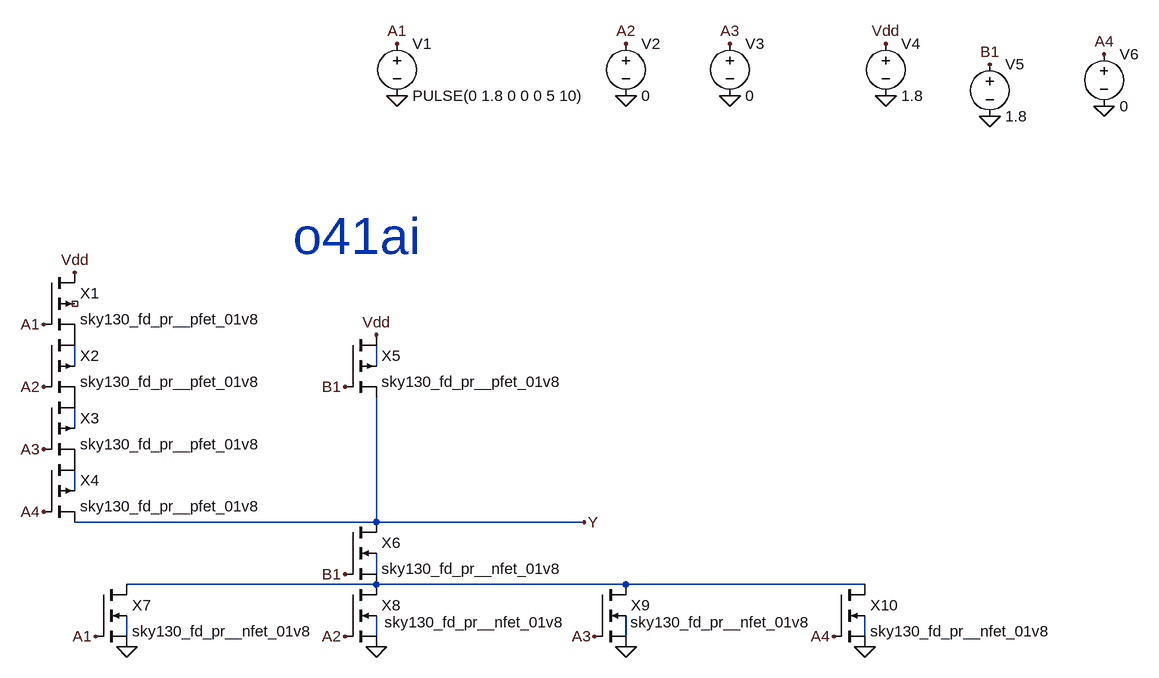
[diagram p0: schematic o41ai.asc]
o41ai.asc, the LTspice schematic file:
Version 4
SHEET 1 1176 680
WIRE -464 -128 -464 -160
WIRE 0 -128 0 -160
WIRE -464 -32 -464 -64
WIRE -464 64 -464 32
WIRE 0 112 0 -80
WIRE 0 112 -464 112
WIRE 320 112 0 112
WIRE 0 192 0 160
WIRE 0 208 -384 208
WIRE 384 208 0 208
WIRE 752 208 384 208
WIRE -384 288 -384 256
WIRE 0 288 0 256
WIRE 384 288 384 256
WIRE 752 288 752 256
FLAG -512 -96 A2
FLAG -512 0 A3
FLAG -512 96 A4
FLAG -48 192 B1
FLAG -384 304 0
FLAG 0 304 0
FLAG 384 304 0
FLAG -432 288 A1
FLAG -48 288 A2
FLAG 336 288 A3
FLAG -48 -96 B1
FLAG 0 -176 Vdd
FLAG 320 112 Y
FLAG -512 -192 A1
FLAG -464 -272 Vdd
FLAG 752 304 0
FLAG 704 288 A4
FLAG 32 -544 0
FLAG 384 -544 0
FLAG 544 -544 0
FLAG 32 -624 A1
FLAG 384 -624 A2
FLAG 544 -624 A3
FLAG 784 -624 Vdd
FLAG 784 -544 0
FLAG 944 -512 0
FLAG 944 -592 B1
FLAG 1120 -528 0
FLAG 1120 -608 A4
SYMBOL pmos4 -512 -176 R0
SYMATTR InstName X2
SYMATTR Value2 l=0.13u w=4u
SYMATTR Value sky130_fd_pr__pfet_01v8
SYMBOL pmos4 -512 -80 R0
SYMATTR InstName X3
SYMATTR Value2 l=0.13u w=4u
SYMATTR Value sky130_fd_pr__pfet_01v8
SYMBOL pmos4 -512 16 R0
SYMATTR InstName X4
SYMATTR Value2 l=0.13u w=4u
SYMATTR Value sky130_fd_pr__pfet_01v8
SYMBOL pmos4 -48 -176 R0
SYMATTR InstName X5
SYMATTR Value2 l=0.13u w=4u
SYMATTR Value sky130_fd_pr__pfet_01v8
SYMBOL nmos4 -48 112 R0
SYMATTR InstName X6
SYMATTR Value2 l=0.13u w=2u
SYMATTR Value sky130_fd_pr__nfet_01v8
SYMBOL nmos4 -432 208 R0
SYMATTR InstName X7
SYMATTR Value2 l=0.13u w=2u
SYMATTR Value sky130_fd_pr__nfet_01v8
SYMBOL nmos4 -48 208 R0
WINDOW 3 61 58 Left 2
SYMATTR Value sky130_fd_pr__nfet_01v8
SYMATTR InstName X8
SYMATTR Value2 l=0.13u w=2u
SYMBOL nmos4 336 208 R0
WINDOW 3 55 58 Left 2
SYMATTR Value sky130_fd_pr__nfet_01v8
SYMATTR InstName X9
SYMATTR Value2 l=0.13u w=2u
SYMBOL pmos4 -512 -272 R0
SYMATTR InstName X1
SYMATTR Value2 l=0.13u w=4u
SYMATTR Value sky130_fd_pr__pfet_01v8
SYMBOL nmos4 704 208 R0
SYMATTR InstName X10
SYMATTR Value2 l=0.13u w=2u
SYMATTR Value sky130_fd_pr__nfet_01v8
SYMBOL voltage 32 -640 R0
WINDOW 123 0 0 Left 0
WINDOW 39 0 0 Left 0
SYMATTR InstName V1
SYMATTR Value PULSE(0 1.8 0 0 0 5 10)
SYMBOL voltage 384 -640 R0
WINDOW 123 0 0 Left 0
WINDOW 39 0 0 Left 0
SYMATTR InstName V2
SYMATTR Value 0
SYMBOL voltage 544 -640 R0
WINDOW 123 0 0 Left 0
WINDOW 39 0 0 Left 0
SYMATTR InstName V3
SYMATTR Value 0
SYMBOL voltage 784 -640 R0
WINDOW 123 0 0 Left 0
WINDOW 39 0 0 Left 0
SYMATTR InstName V4
SYMATTR Value 1.8
SYMBOL voltage 944 -608 R0
WINDOW 123 0 0 Left 0
WINDOW 39 0 0 Left 0
SYMATTR InstName V5
SYMATTR Value 1.8
SYMBOL voltage 1120 -624 R0
WINDOW 123 0 0 Left 0
WINDOW 39 0 0 Left 0
SYMATTR InstName V6
SYMATTR Value 0
TEXT -128 -328 Left 6 ;o41ai

The netlist it stands for:
* o41ai.asc
M§X2 P001 A2 P002 N001 sky130_fd_pr__pfet_01v8 l=0.13u w=4u
M§X3 P002 A3 P003 N003 sky130_fd_pr__pfet_01v8 l=0.13u w=4u
M§X4 P003 A4 Y N004 sky130_fd_pr__pfet_01v8 l=0.13u w=4u
M§X5 Vdd B1 Y N002 sky130_fd_pr__pfet_01v8 l=0.13u w=4u
M§X6 Y B1 N006 N005 sky130_fd_pr__nfet_01v8 l=0.13u w=2u
M§X7 N006 A1 0 N007 sky130_fd_pr__nfet_01v8 l=0.13u w=2u
M§X8 N006 A2 0 N008 sky130_fd_pr__nfet_01v8 l=0.13u w=2u
M§X9 N006 A3 0 N009 sky130_fd_pr__nfet_01v8 l=0.13u w=2u
M§X1 Vdd A1 P001 NC_01 sky130_fd_pr__pfet_01v8 l=0.13u w=4u
M§X10 N006 A4 0 N010 sky130_fd_pr__nfet_01v8 l=0.13u w=2u
V1 A1 0 PULSE(0 1.8 0 0 0 5 10)
V2 A2 0 0
V3 A3 0 0
V4 Vdd 0 1.8
V5 B1 0 1.8
V6 A4 0 0
.model NMOS NMOS
.model PMOS PMOS
.lib standard.mos
* o41ai
.backanno
.end